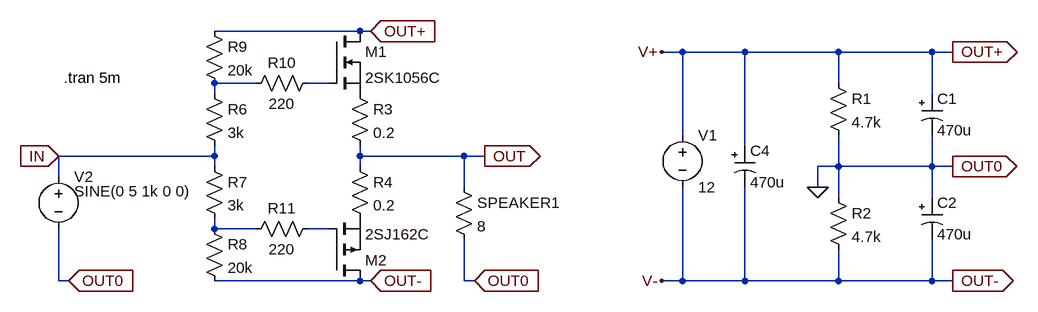
[diagram p0: schematic Circuit7_26.asc]
Circuit7_26.asc, the LTspice schematic file:
Version 4
SHEET 1 1120 680
WIRE -32 -336 -256 -336
WIRE -16 -336 -32 -336
WIRE 464 -304 432 -304
WIRE 560 -304 464 -304
WIRE 704 -304 560 -304
WIRE 848 -304 704 -304
WIRE 880 -304 848 -304
WIRE -192 -256 -256 -256
WIRE -80 -256 -112 -256
WIRE 704 -256 704 -304
WIRE -256 -240 -256 -256
WIRE 848 -240 848 -304
WIRE 464 -176 464 -304
WIRE 560 -160 560 -304
WIRE -256 -144 -256 -160
WIRE -256 -144 -496 -144
WIRE -32 -144 -32 -160
WIRE 128 -144 -32 -144
WIRE 160 -144 128 -144
WIRE -256 -128 -256 -144
WIRE -32 -128 -32 -144
WIRE 704 -128 704 -176
WIRE 704 -128 672 -128
WIRE 848 -128 848 -176
WIRE 848 -128 704 -128
WIRE 880 -128 848 -128
WIRE -496 -112 -496 -144
WIRE 128 -96 128 -144
WIRE 672 -96 672 -128
WIRE 704 -80 704 -128
WIRE 848 -80 848 -128
WIRE -256 -32 -256 -48
WIRE -192 -32 -256 -32
WIRE -80 -32 -112 -32
WIRE -496 48 -496 -32
WIRE -480 48 -496 48
WIRE -32 48 -256 48
WIRE -16 48 -32 48
WIRE 128 48 128 -16
WIRE 144 48 128 48
WIRE 464 48 464 -96
WIRE 464 48 432 48
WIRE 560 48 560 -96
WIRE 560 48 464 48
WIRE 704 48 704 0
WIRE 704 48 560 48
WIRE 848 48 848 -16
WIRE 848 48 704 48
WIRE 880 48 848 48
FLAG 672 -96 0
FLAG 880 -304 OUT+
IOPIN 880 -304 Out
FLAG 880 48 OUT-
IOPIN 880 48 Out
FLAG 880 -128 OUT0
IOPIN 880 -128 Out
FLAG 432 -304 V+
FLAG 432 48 V-
FLAG -16 -336 OUT+
IOPIN -16 -336 In
FLAG -16 48 OUT-
IOPIN -16 48 In
FLAG -480 48 OUT0
IOPIN -480 48 In
FLAG 144 48 OUT0
IOPIN 144 48 In
FLAG 160 -144 OUT
IOPIN 160 -144 Out
FLAG -496 -144 IN
IOPIN -496 -144 In
SYMBOL voltage 464 -192 R0
SYMATTR InstName V1
SYMATTR Value 12
SYMBOL res 688 -272 R0
SYMATTR InstName R1
SYMATTR Value 4.7k
SYMBOL res 688 -96 R0
SYMATTR InstName R2
SYMATTR Value 4.7k
SYMBOL polcap 832 -240 R0
SYMATTR InstName C1
SYMATTR Value 470u
SYMBOL polcap 832 -80 R0
SYMATTR InstName C2
SYMATTR Value 470u
SYMBOL polcap 544 -160 R0
SYMATTR InstName C4
SYMATTR Value 470u
SYMBOL nmos -80 -336 R0
SYMATTR InstName M1
SYMATTR Value 2SK1056C
SYMBOL pmos -80 48 M180
SYMATTR InstName M2
SYMATTR Value 2SJ162C
SYMBOL res -48 -256 R0
SYMATTR InstName R3
SYMATTR Value 0.2
SYMBOL res -48 -144 R0
SYMATTR InstName R4
SYMATTR Value 0.2
SYMBOL res 112 -112 R0
SYMATTR InstName SPEAKER1
SYMATTR Value 8
SYMBOL res -272 -256 R0
SYMATTR InstName R6
SYMATTR Value 3k
SYMBOL res -272 -144 R0
SYMATTR InstName R7
SYMATTR Value 3k
SYMBOL res -272 -48 R0
SYMATTR InstName R8
SYMATTR Value 20k
SYMBOL res -272 -352 R0
SYMATTR InstName R9
SYMATTR Value 20k
SYMBOL res -96 -272 R90
WINDOW 0 0 56 VBottom 2
WINDOW 3 32 56 VTop 2
SYMATTR InstName R10
SYMATTR Value 220
SYMBOL res -96 -48 R90
WINDOW 0 0 56 VBottom 2
WINDOW 3 32 56 VTop 2
SYMATTR InstName R11
SYMATTR Value 220
SYMBOL voltage -496 -128 R0
WINDOW 3 24 38 Left 2
SYMATTR Value SINE(0 5 1k 0 0)
SYMATTR InstName V2
TEXT -488 -264 Left 2 !.tran 5m

The netlist it stands for:
* Circuit7_26.asc
V1 V+ V- 12
R1 V+ 0 4.7k
R2 0 V- 4.7k
C1 V+ 0 470u
C2 0 V- 470u
C4 V+ V- 470u
M1 V+ N002 P001 P001 2SK1056C
M2 V- N004 P002 P002 2SJ162C
R3 P001 OUT 0.2
R4 OUT P002 0.2
R§SPEAKER1 OUT 0 8
R6 N001 IN 3k
R7 IN N003 3k
R8 N003 V- 20k
R9 V+ N001 20k
R10 N002 N001 220
R11 N004 N003 220
V2 IN 0 SINE(0 5 1k 0 0)
.model NMOS NMOS
.model PMOS PMOS
.lib standard.mos
.tran 5m
.backanno
.end